# EAGLE design T4p1 (EAGLE 9.6.2)
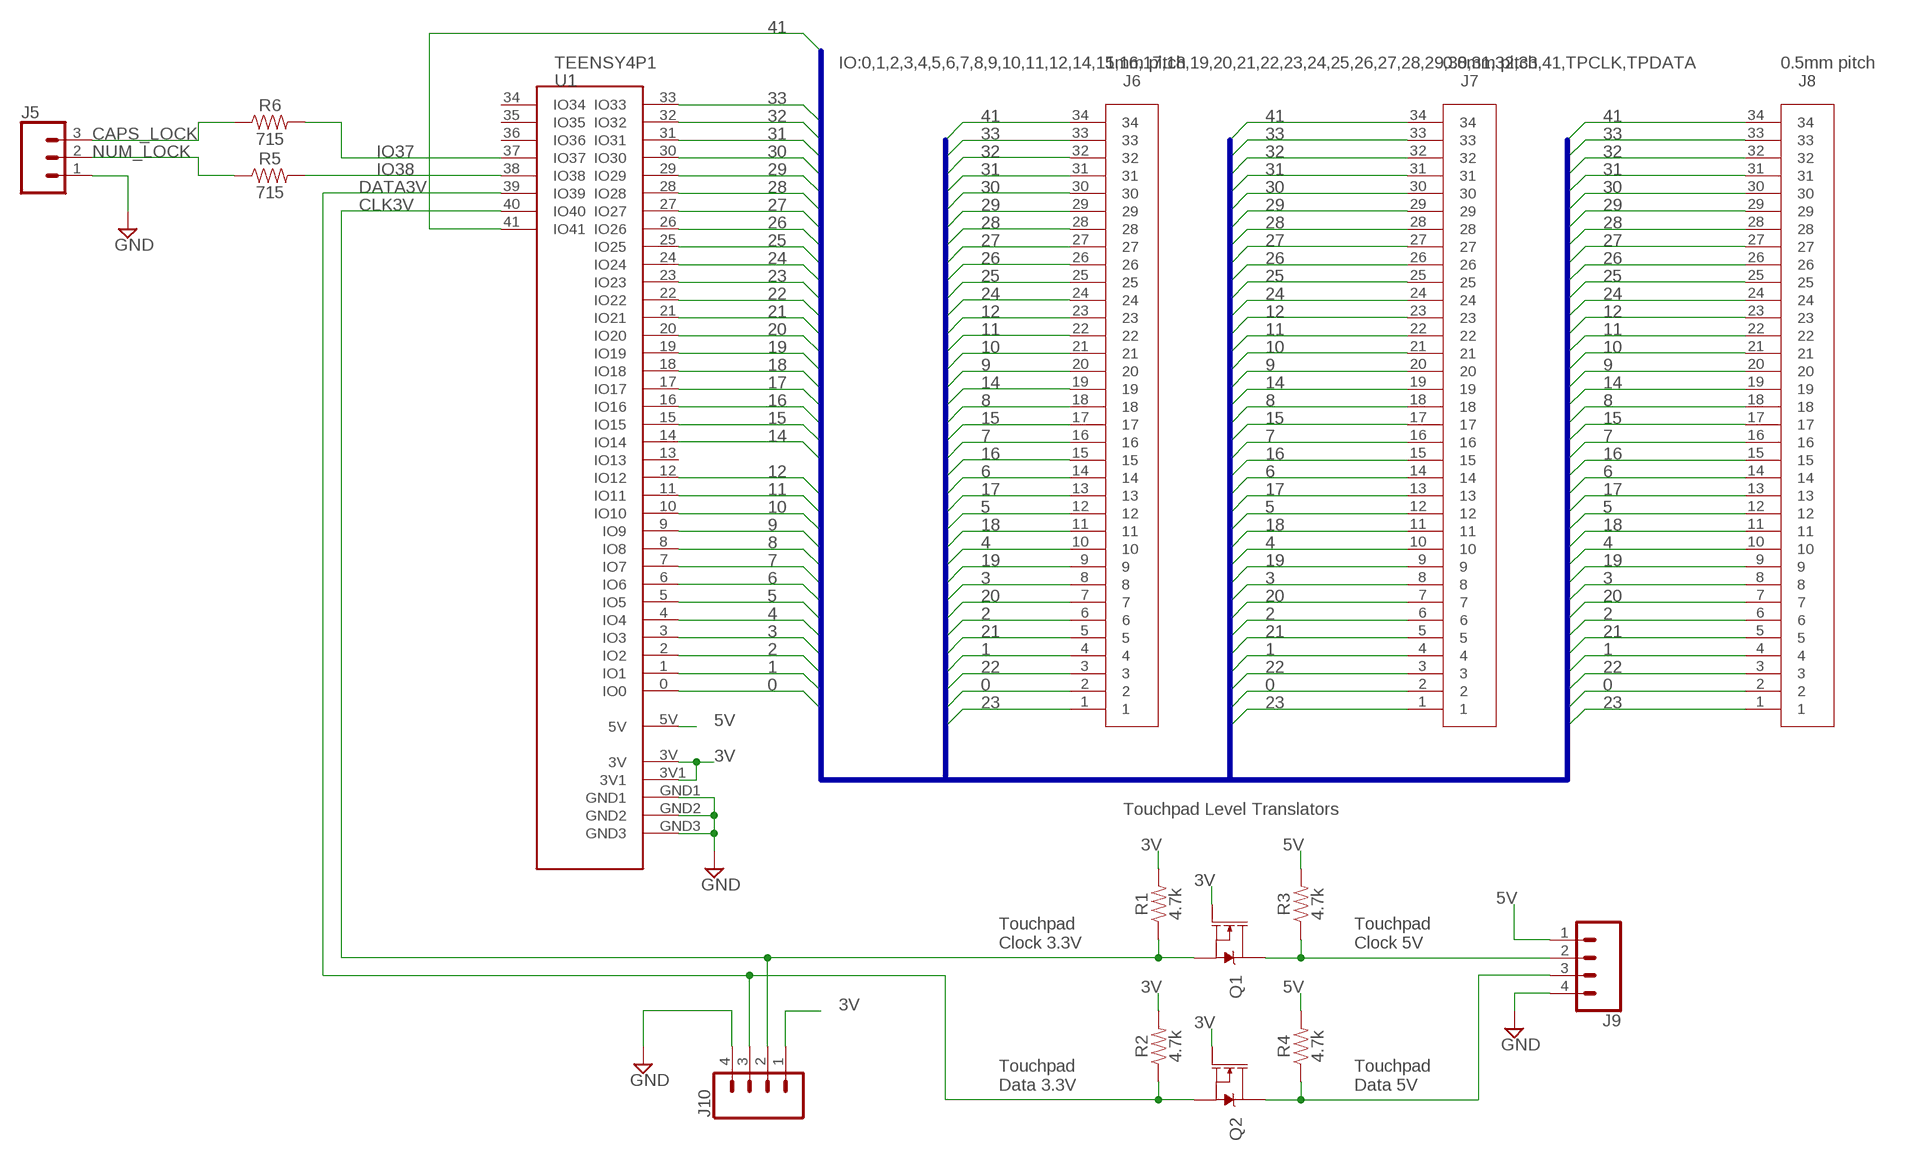
[diagram p0: schematic, sheet 1]

## Parts
J5  CONN_031X03_NO_SILK  [1X03_NO_SILK]
J6  FPC34  [FPC34]
J7  FPC34_P8MM  [FPC34_P8MM]
J8  FPC34_P5MM  [FPC34_P5MM]
J9  CONN_041X04_NO_SILK  [1X04_NO_SILK]
J10  CONN_041X04_NO_SILK  [1X04_NO_SILK]
Q1  220mA/50V/3.5Ω  MOSFET-NCH-BSS138  [SOT23-3]
Q2  220mA/50V/3.5Ω  MOSFET-NCH-BSS138  [SOT23-3]
R1  4.7k  4.7KOHM-0603-1/10W-1%  [0603]
R2  4.7k  4.7KOHM-0603-1/10W-1%  [0603]
R3  4.7k  4.7KOHM-0603-1/10W-1%  [0603]
R4  4.7k  4.7KOHM-0603-1/10W-1%  [0603]
R5  715  715OHM-0603-1/10W-1%  [0603]
R6  715  715OHM-0603-1/10W-1%  [0603]
U1  TEENSY4P1  TEENSYP41  [TEENSY4P1]

## Nets
0: J6.2 J7.2 J8.2 U1.0(IO0)
1: J6.4 J7.4 J8.4 U1.1(IO1)
2: J6.6 J7.6 J8.6 U1.2(IO2)
3: J6.8 J7.8 J8.8 U1.3(IO3)
3V: J10.1 Q1.1(G) Q2.1(G) R1.2 R2.2 U1.3V U1.3V1
4: J6.10 J7.10 J8.10 U1.4(IO4)
5: J6.12 J7.12 J8.12 U1.5(IO5)
5V: J9.1 R3.2 R4.2 U1.5V
6: J6.14 J7.14 J8.14 U1.6(IO6)
7: J6.16 J7.16 J8.16 U1.7(IO7)
8: J6.18 J7.18 J8.18 U1.8(IO8)
9: J6.20 J7.20 J8.20 U1.9(IO9)
10: J6.21 J7.21 J8.21 U1.10(IO10)
11: J6.22 J7.22 J8.22 U1.11(IO11)
12: J6.23 J7.23 J8.23 U1.12(IO12)
14: J6.19 J7.19 J8.19 U1.14(IO14)
15: J6.17 J7.17 J8.17 U1.15(IO15)
16: J6.15 J7.15 J8.15 U1.16(IO16)
17: J6.13 J7.13 J8.13 U1.17(IO17)
18: J6.11 J7.11 J8.11 U1.18(IO18)
19: J6.9 J7.9 J8.9 U1.19(IO19)
20: J6.7 J7.7 J8.7 U1.20(IO20)
21: J6.5 J7.5 J8.5 U1.21(IO21)
22: J6.3 J7.3 J8.3 U1.22(IO22)
23: J6.1 J7.1 J8.1 U1.23(IO23)
24: J6.24 J7.24 J8.24 U1.24(IO24)
25: J6.25 J7.25 J8.25 U1.25(IO25)
26: J6.26 J7.26 J8.26 U1.26(IO26)
27: J6.27 J7.27 J8.27 U1.27(IO27)
28: J6.28 J7.28 J8.28 U1.28(IO28)
29: J6.29 J7.29 J8.29 U1.29(IO29)
30: J6.30 J7.30 J8.30 U1.30(IO30)
31: J6.31 J7.31 J8.31 U1.31(IO31)
32: J6.32 J7.32 J8.32 U1.32(IO32)
33: J6.33 J7.33 J8.33 U1.33(IO33)
41: J6.34 J7.34 J8.34 U1.41(IO41)
CAPS_LOCK: J5.3 R6.1
CLK3V: J10.2 Q1.2(S) R1.1 U1.40(IO40)
CLK5V: J9.2 Q1.3(D) R3.1
DATA3V: J10.3 Q2.2(S) R2.1 U1.39(IO39)
DATA5V: J9.3 Q2.3(D) R4.1
GND: J5.1 J9.4 J10.4 U1.GND1 U1.GND2 U1.GND3
IO37: R6.2 U1.37(IO37)
IO38: R5.2 U1.38(IO38)
NUM_LOCK: J5.2 R5.1
Unconnected: U1.13(IO13) U1.34(IO34) U1.35(IO35) U1.36(IO36)

## Buses
IO:0,1,2,3,4,5,6,7,8,9,10,11,12,14,15,16,17,18,19,20,21,22,23,24,25,26,27,28,29,30,31,32,33,41,TPCLK,TPDATA

## Notes on the sheet
- 1mm pitch | 0.8mm pitch | 0.5mm pitch
- Touchpad Level Translators
- Touchpad
  Clock 3.3V
- Touchpad
  Clock 5V
- Touchpad
  Data 3.3V
- Touchpad
  Data 5V

## Library data of the parts
J5 = SparkFun-Connectors:CONN_03: Multi connection point. Often used as Generic Header-pin footprint for 0.1 inch spaced/style header connections On any of the 0.1 inch spaced packages, you can populate with these: Break Away Headers - Straight <https://www.sparkfun.com/products/116> (PRT-00116) Break Away Male Headers - Right Angle <https://www.sparkfun.com/products/553> (PRT-00553) Female Headers <https://www.sparkfun.com/products/115> (PRT-00115) Break Away Headers - Machine Pin <https://www.sparkfun.com/products/117> (PRT-00117) Break Away Female Headers - Swiss Machine Pin <https://www.sparkfun.com/products/743> (PRT-00743) Stackable Header - 3 Pin (Female, 0.1") <https://www.sparkfun.com/products/13875> (PRT-13875) For SCREWTERMINALS and SPRING TERMINALS visit here: Screw Terimnals on SparkFun.com <https://www.sparkfun.com/search/results?term=Screw+Terminals> (5mm/3.5mm/2.54mm spacing) This device is also useful as a general connection point to wire up your design to another part of your project. Our various solder wires solder well into these plated through hole pads. Hook-Up Wire - Assortment (Stranded, 22 AWG) <https://www.sparkfun.com/products/11375> (PRT-11375) Hook-Up Wire - Assortment (Solid Core, 22 AWG) <https://www.sparkfun.com/products/11367> (PRT-11367) View the entire wire category on our website here <https://www.sparkfun.com/categories/141> Special notes: Molex polarized connector foot print use with SKU : PRT-08232 with associated crimp pins and housings.
J6 = FPC34:FPC34: Molex Right Angle FPC Connector 1mm pitch, bottom contacts with 32 pins. Molex Part Number DigiKey Part Number
J7 = FPC34_p8mm:FPC34_P8MM: Molex Right Angle FPC Connector 1mm pitch, bottom contacts with 32 pins. Molex Part Number DigiKey Part Number
J8 = FPC34_p5mm:FPC34_P5MM: Molex Right Angle FPC Connector 1mm pitch, bottom contacts with 32 pins. Molex Part Number DigiKey Part Number
J9 J10 = SparkFun-Connectors:CONN_04: Multi connection point. Often used as Generic Header-pin footprint for 0.1 inch spaced/style header connections On any of the 0.1 inch spaced packages, you can populate with these: Break Away Headers - Straight <https://www.sparkfun.com/products/116> (PRT-00116) Break Away Male Headers - Right Angle <https://www.sparkfun.com/products/553> (PRT-00553) Female Headers <https://www.sparkfun.com/products/115> (PRT-00115) Break Away Headers - Machine Pin <https://www.sparkfun.com/products/117> (PRT-00117) Break Away Female Headers - Swiss Machine Pin <https://www.sparkfun.com/products/743> (PRT-00743) For SCREWTERMINALS and SPRING TERMINALS visit here: Screw Terimnals on SparkFun.com <https://www.sparkfun.com/search/results?term=Screw+Terminals> (5mm/3.5mm/2.54mm spacing) This device is also useful as a general connection point to wire up your design to another part of your project. Our various solder wires solder well into these plated through hole pads. Hook-Up Wire - Assortment (Stranded, 22 AWG) <https://www.sparkfun.com/products/11375> (PRT-11375) Hook-Up Wire - Assortment (Solid Core, 22 AWG) <https://www.sparkfun.com/products/11367> (PRT-11367) View the entire wire category on our website here <https://www.sparkfun.com/categories/141> Special notes: Molex polarized connector foot print use with SKU : PRT-08231 with associated crimp pins and housings. 1MM SMD Version SKU: PRT-10208; PROD_ID: CONN-09696
Q1 Q2 = SparkFun-DiscreteSemi:MOSFET-NCH: N-channel MOSFETs Voltage controlled devices that allow control of high current outputs. SparkFun Products: SparkFun OpenScale <https://www.sparkfun.com/products/13261> SparkFun Digital Sandbox <https://www.sparkfun.com/products/12651> SparkFun Monster Moto Shield <https://www.sparkfun.com/products/10182> SparkFun MOSFET Power Controller <https://www.sparkfun.com/products/11214>; PROD_ID: TRANS-00830
R1-R4 = SparkFun-Resistors:4.7KOHM: 4.7kΩ resistor A resistor is a passive two-terminal electrical component that implements electrical resistance as a circuit element. Resistors act to reduce current flow, and, at the same time, act to lower voltage levels within circuits. - Wikipedia; PROD_ID: RES-07857
R5 R6 = SparkFun-Resistors:715OHM: 715Ω resistor A resistor is a passive two-terminal electrical component that implements electrical resistance as a circuit element. Resistors act to reduce current flow, and, at the same time, act to lower voltage levels within circuits. - Wikipedia; PROD_ID: RES-07850
U1 = TEENSY4P1:TEENSYP41

## Board
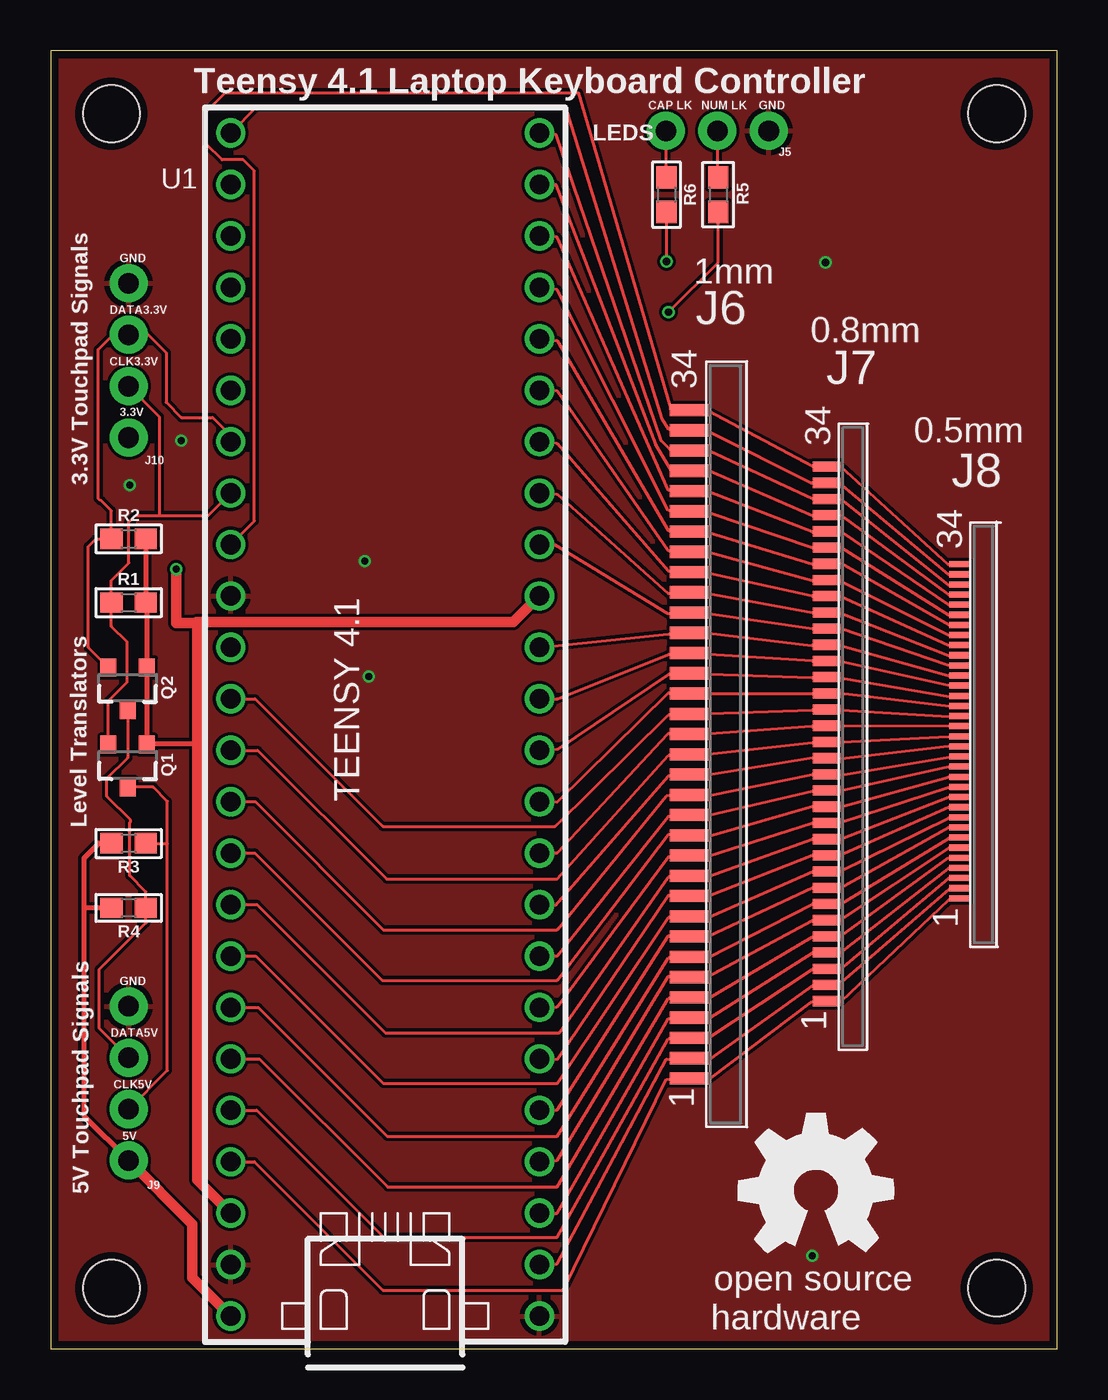
[diagram p1: board, top side]
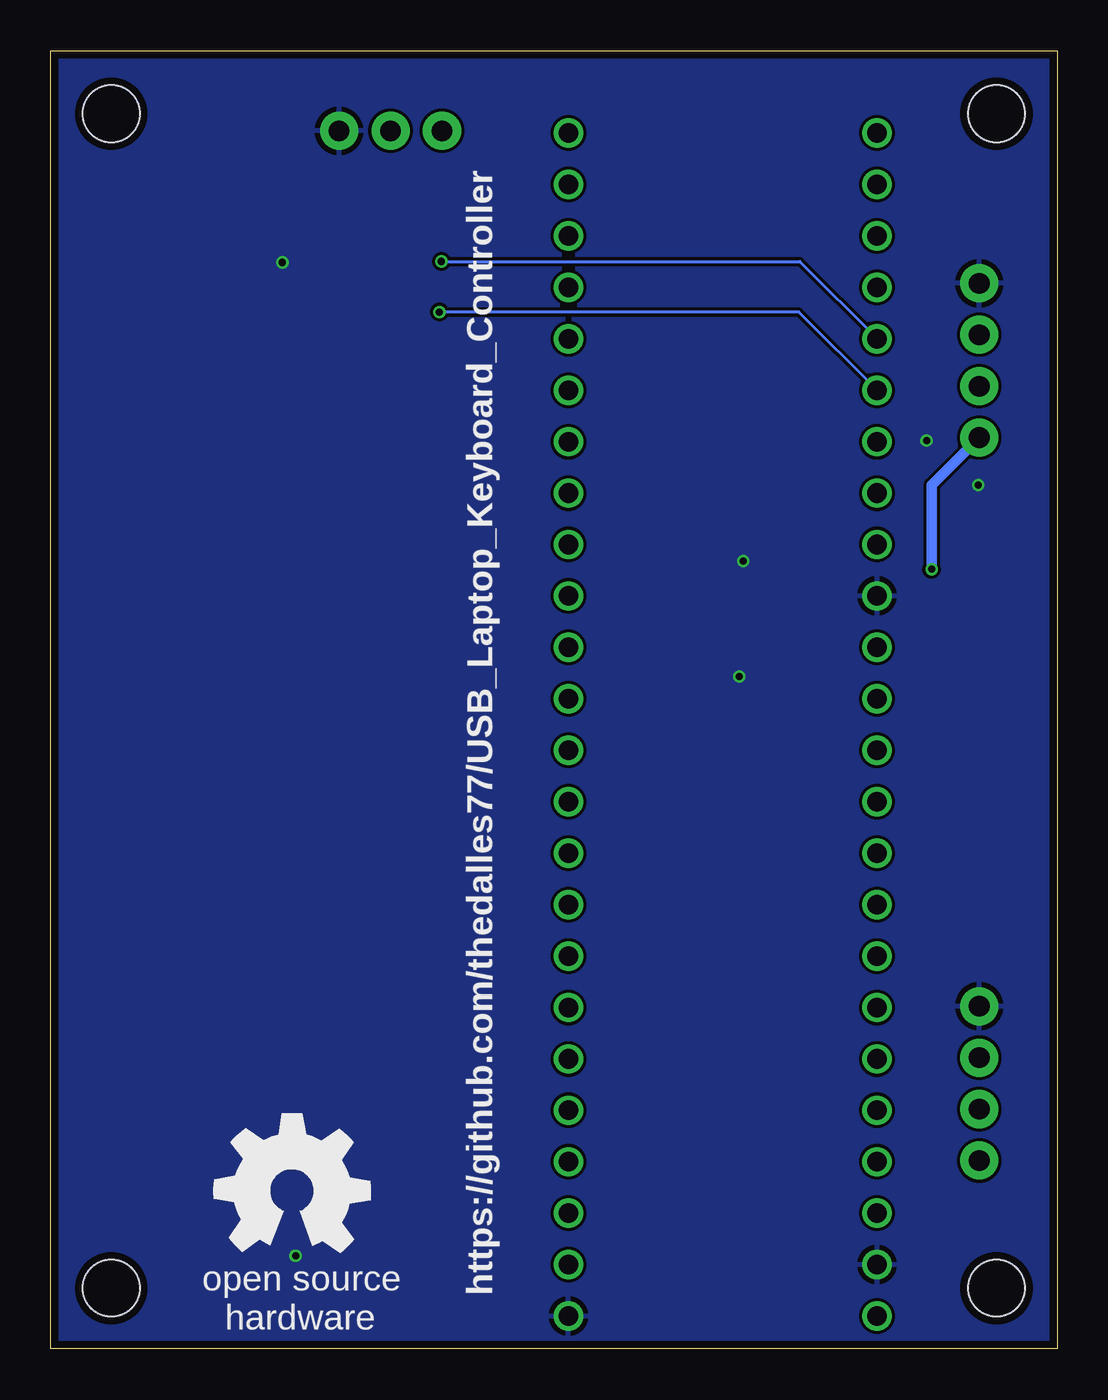
[diagram p2: board, bottom side, seen from below]

Size 49.69 x 64.11 mm. Coordinates in mm from the lower left corner, seen from the top.
Outline: 0,0 49.69,0 49.69,64.11 0,64.11 0,0
Copper layers (1*16): Top 0.035559375mm / dielectric 1.6mm / Bottom 0.035559375mm
Design rules "oshpark-2layer": minimum track width 6mil, minimum drill 10mil, track to track 6mil, track to pad 6mil, pad to pad 6mil, via to via 6mil, smd to smd 6mil, copper to edge 15mil, drill to drill 6mil, minimum pad ring 5mil, minimum via ring 5mil, stop-mask expansion 2.5mil, vias tented up to drill 0mil, thermal gap 10mil
Holes 2.8 mm at 3,3 46.7,3 46.7,61 3,61

### Footprints (pad centres in the part's own frame; a part is rotated, then mirrored left to right if it is on the bottom)
1X03_NO_SILK = drill 1.016 pad 1.88: 1 0,0; 2 2.54,0; 3 5.08,0
FPC34 = smd 0.6 x 1.9: 1 -13.7,3.86; 2 -12.7,3.86; 3 -11.7,3.86; 4 -10.7,3.86; 5 -9.7,3.86; 6 -8.7,3.86; 7 -7.7,3.86; 8 -6.7,3.86; 9 -5.7,3.86; 10 -4.7,3.86; 11 -3.7,3.86; 12 -2.7,3.86; 13 -1.7,3.86; 14 -0.7,3.86; 15 0.3,3.86; 16 1.3,3.86; 17 2.3,3.86; 18 3.3,3.86; 19 4.3,3.86; 20 5.3,3.86; 21 6.3,3.86; 22 7.3,3.86; 23 8.3,3.86; 24 9.3,3.86; 25 10.3,3.86; 26 11.3,3.86; 27 12.3,3.86; 28 13.3,3.86; 29 14.3,3.86; 30 15.3,3.86; 31 16.3,3.86; 32 17.3,3.86; 33 18.3,3.86; 34 19.3,3.86
FPC34_P8MM = smd 0.5 x 1.35: 1 -13.7,3.6; 2 -12.9,3.6; 3 -12.1,3.6; 4 -11.3,3.6; 5 -10.5,3.6; 6 -9.7,3.6; 7 -8.9,3.6; 8 -8.1,3.6; 9 -7.3,3.6; 10 -6.5,3.6; 11 -5.7,3.6; 12 -4.9,3.6; 13 -4.1,3.6; 14 -3.3,3.6; 15 -2.5,3.6; 16 -1.7,3.6; 17 -0.9,3.6; 18 -0.1,3.6; 19 0.7,3.6; 20 1.5,3.6; 21 2.3,3.6; 22 3.1,3.6; 23 3.9,3.6; 24 4.7,3.6; 25 5.5,3.6; 26 6.3,3.6; 27 7.1,3.6; 28 7.9,3.6; 29 8.7,3.6; 30 9.5,3.6; 31 10.3,3.6; 32 11.1,3.6; 33 11.9,3.6; 34 12.7,3.6
FPC34_P5MM = smd 0.3 x 1.1: 1 -13.7,3.5; 2 -13.2,3.5; 3 -12.7,3.5; 4 -12.2,3.5; 5 -11.7,3.5; 6 -11.2,3.5; 7 -10.7,3.5; 8 -10.2,3.5; 9 -9.7,3.5; 10 -9.2,3.5; 11 -8.7,3.5; 12 -8.2,3.5; 13 -7.7,3.5; 14 -7.2,3.5; 15 -6.7,3.5; 16 -6.2,3.5; 17 -5.7,3.5; 18 -5.2,3.5; 19 -4.7,3.5; 20 -4.2,3.5; 21 -3.7,3.5; 22 -3.2,3.5; 23 -2.7,3.5; 24 -2.2,3.5; 25 -1.7,3.5; 26 -1.2,3.5; 27 -0.7,3.5; 28 -0.2,3.5; 29 0.3,3.5; 30 0.8,3.5; 31 1.3,3.5; 32 1.8,3.5; 33 2.3,3.5; 34 2.8,3.5
1X04_NO_SILK = drill 1.016 pad 1.88: 1 0,0; 2 2.54,0; 3 5.08,0; 4 7.62,0
SOT23-3 = smd 0.8 x 0.9: 1 -0.95,-1; 2 0.95,-1; 3 0,1.1
0603 = smd 1.1 x 1: 1 -0.85,0; 2 0.85,0
TEENSY4P1 = drill 0.965: 0 -26.67,-6.35; 1 -24.13,-6.35; 2 -21.59,-6.35; 3 -19.05,-6.35; 3V -24.13,8.89; 3V1 6.35,-6.35; 4 -16.51,-6.35; 5 -13.97,-6.35; 5V -29.21,8.89; 6 -11.43,-6.35; 7 -8.89,-6.35; 8 -6.35,-6.35; 9 -3.81,-6.35; 10 -1.27,-6.35; 11 1.27,-6.35; 12 3.81,-6.35; 13 3.81,8.89; 14 1.27,8.89; 15 -1.27,8.89; 16 -3.81,8.89; 17 -6.35,8.89; 18 -8.89,8.89; 19 -11.43,8.89; 20 -13.97,8.89; 21 -16.51,8.89; 22 -19.05,8.89; 23 -21.59,8.89; 24 8.89,-6.35; 25 11.43,-6.35; 26 13.97,-6.35; 27 16.51,-6.35; 28 19.05,-6.35; 29 21.59,-6.35; 30 24.13,-6.35; 31 26.67,-6.35; 32 29.21,-6.35; 33 29.21,8.89; 34 26.67,8.89; 35 24.13,8.89; 36 21.59,8.89; 37 19.05,8.89; 38 16.51,8.89; 39 13.97,8.89; 40 11.43,8.89; 41 8.89,8.89; GND1 -29.21,-6.35; GND2 -26.67,8.89; GND3 6.35,8.89

### Placement (x,y rotation side)
J5  35.45,60.15 180 top
J6  35.37,27.06 90 top
J7  41.9,30.87 90 top
J8  48.4,35.95 90 top
J9  3.85,9.3 90 top
J10  3.85,45 90 top
Q1  3.8,28.84 180 top
Q2  3.8,32.65 180 top
R1  3.85,36.85 0 top
R2  3.85,40 0 top
R3  3.85,24.97 180 top
R4  3.85,21.78 180 top
R5  32.95,57 270 top
R6  30.4,57 270 top
U1  17.78,30.83 90 top
U$1  [OSHW_8MM]  37.75,7.8 0 top
U$2  [OSHW_8MM]  37.75,7.8 0 top

### Tracks (layer width: path | path; a pad name or v marks a point on that pad's centre or on a via)
0
  Top 0.152: U1.0 25,4.2 30.4,14.3 J6.2 32.61,14.35 37.65,17.96 J7.2 39.06,18.11 44.36,22.72 J8.2
1
  Top 0.152: U1.1 25,6.7 30.5,16.3 J6.4 32.52,16.33 37.61,19.56 J7.4 39.01,19.58 44.32,23.73 J8.4
2
  Top 0.152: U1.2 25,9.3 30.5,18.4 J6.6 32.41,18.35 37.6,21.13 J7.6 38.99,21.18 44.33,24.73 J8.6
3
  Top 0.152: U1.3 25,11.8 30.5,20.4 J6.8 32.48,20.36 37.63,22.75 J7.8 38.99,22.74 44.35,25.75 J8.8
3V  (via drill 0.35)
  Top 0.254: R2.2 R1.2 4.75,36.8 Q2.1 Q1.1 4.75,29.9 7.24,29.9 | 7.24,35.86 7.21,35.89
  Top 0.508: U1.3V1 22.84,35.89 7.21,35.89 | U1.3V 7.24,8.35 7.24,29.9 7.24,35.85 | v6.2,38.5 6.2,35.85 7.24,35.85 | 7.24,35.85 7.24,35.86
  Bottom 0.508: v6.2,38.5 6.2,42.65 J10.1
4
  Top 0.152: U1.4 25,14.3 30.5,22.4 J6.10 32.46,22.35 37.61,24.36 J7.10 38.99,24.36 44.33,26.73 J8.10
5
  Top 0.152: U1.5 25,16.9 30.5,24.3 J6.12 32.48,24.32 37.6,25.94 J7.12 38.99,25.98 44.35,27.72 J8.12
5V
  Top 0.254: R3.2 2.4,24.97 2.39,24.98 1.64,24.23 1.64,21.78 | 1.64,21.78 1.64,11.52 J9.1 | R4.2 1.64,21.78
  Top 0.508: U1.5V 7,3.51 7,6.15 J9.1
6
  Top 0.152: U1.6 25,19.4 30.5,26.3 J6.14 32.5,26.35 37.6,27.53 J7.14 39.01,27.54 44.32,28.73 J8.14
7
  Top 0.152: U1.7 24.9,21.9 30.5,28.3 31.43,28.36 | 31.43,28.36 J6.16 | 31.43,28.36 32.5,28.34 37.63,29.17 J7.16 39.03,29.14 44.32,29.75 J8.16
8
  Top 0.152: U1.8 25,24.5 30.5,30.4 J6.18 32.5,30.36 37.58,30.73 J7.18 39.01,30.73 44.34,30.75 J8.18
9
  Top 0.152: U1.9 25,27 30.5,32.4 J6.20 32.45,32.35 37.61,32.35 J7.20 38.98,32.37 44.36,31.72 J8.20
10
  Top 0.152: U1.10 25,29.6 30.5,33.3 J6.21 32.48,33.33 37.58,33.15 J7.21 39.03,33.12 44.36,32.21 J8.21
11
  Top 0.152: U1.11 25,32.1 30.5,34.3 J6.22 32.46,34.29 37.61,33.96 J7.22 38.99,33.94 44.32,32.77 J8.22
12
  Top 0.152: U1.12 30.5,35.3 J6.23 32.46,35.34 37.58,34.74 J7.23 39.01,34.73 44.32,33.26 J8.23
14
  Top 0.152: J8.19 44.39,31.23 39.01,31.55 J7.19 37.6,31.55 32.5,31.37 J6.19 30.5,31.3 24.9,25.8 16.4,25.8 10.1,32.1 U1.14
15
  Top 0.152: J8.17 44.34,30.24 39.03,29.96 J7.17 37.6,29.94 32.48,29.38 J6.17 30.5,29.3 25,23.2 16.58,23.2 10.22,29.56 U1.15
16
  Top 0.152: J8.15 44.36,29.24 39.04,28.34 J7.15 37.6,28.37 32.5,27.34 J6.15 30.4,27.3 25,20.7 16.43,20.7 10.11,27.02 U1.16
17
  Top 0.152: J8.13 44.33,28.25 38.98,26.77 J7.13 37.65,26.8 32.5,25.33 J6.13 30.5,25.4 25,18.2 16.36,18.2 10.08,24.48 U1.17
18
  Top 0.152: J8.11 44.33,27.25 39.01,25.18 J7.11 37.61,25.19 32.46,23.33 J6.11 30.5,23.3 25.1,15.6 16.52,15.6 10.18,21.94 U1.18
19
  Top 0.152: J8.9 44.33,26.23 38.95,23.58 J7.9 37.63,23.57 32.5,21.34 J6.9 30.5,21.3 25,13.1 16.42,13.1 10.12,19.4 U1.19
20
  Top 0.152: J8.7 44.33,25.21 38.97,21.96 J7.7 37.61,21.98 32.46,19.33 J6.7 30.5,19.3 25,10.5 16.61,10.5 10.25,16.86 U1.20
21
  Top 0.152: J8.5 44.32,24.24 39.02,20.4 J7.5 37.6,20.34 32.5,17.34 J6.5 30.5,17.3 25,8 16.63,8 10.31,14.32 U1.21
22
  Top 0.152: J8.3 44.33,23.24 39.01,18.73 J7.3 37.6,18.75 32.5,15.38 J6.3 30.5,15.3 25,5.5 16.45,5.5 10.17,11.78 U1.22
23
  Top 0.152: U1.23 10.06,9.24 16.4,2.9 25.3,2.9 30.4,13.3 J6.1 32.52,13.3 37.57,17.13 J7.1 39.04,17.17 44.37,22.2 J8.1
24
  Top 0.152: U1.24 24.9,39.7 30.5,36.3 J6.24 32.48,36.28 37.61,35.55 J7.24 38.98,35.56 44.32,33.75 J8.24
25
  Top 0.152: U1.25 25,42.2 30.5,37.3 J6.25 32.48,37.31 37.6,36.35 J7.25 39.01,36.33 44.34,34.24 J8.25
26
  Top 0.152: U1.26 25,44.7 30.5,38.4 J6.26 32.5,38.29 37.58,37.17 J7.26 38.99,37.15 44.32,34.74 J8.26
27
  Top 0.152: U1.27 25,47.3 30.5,39.4 J6.27 32.48,39.35 37.61,37.95 J7.27 39.01,37.92 44.34,35.25 J8.27
28
  Top 0.152: U1.28 25,49.8 30.5,40.4 J6.28 | J6.28 | J7.28 38.24,38.77 | 38.24,38.77 37.61,38.74 32.5,40.28 J6.28 | J8.28 44.34,35.74 39.03,38.79 38.24,38.77
29
  Top 0.152: U1.29 25,52.3 30.5,41.4 J6.29 32.52,41.31 37.61,39.56 J7.29 39.03,39.56 44.34,36.24 J8.29
30
  Top 0.152: U1.30 25,54.9 30.5,42.4 J6.30 32.5,42.32 37.61,40.33 J7.30 39.03,40.35 44.36,36.73 J8.30
31
  Top 0.152: U1.31 24.94,57.5 29.86,44.63 30.6,43.4 J6.31 32.5,43.37 37.61,41.15 J7.31 39.03,41.15 44.32,37.26 J8.31
32
  Top 0.152: U1.32 24.95,59.97 30.13,44.85 30.56,44.43 J6.32 32.5,44.33 37.61,41.97 J7.32 39.03,41.93 44.32,37.73 J8.32
33
  Top 0.152: U1.33 10.18,61.33 25.43,61.33 30.18,45.92 30.52,45.4 J6.33 32.52,45.3 37.58,42.76 J7.33 38.99,42.74 44.34,38.23 J8.33
41
  Top 0.152: U1.41 10.06,40.89 10.06,58.17 9.51,58.72 8.47,58.72 7.69,59.5 7.69,61.09 8.63,62.03 26.05,62.03 30.61,46.4 J6.34 32.45,46.32 37.61,43.58 J7.34 38.99,43.59 44.32,38.74 J8.34
CAPS_LOCK
  Top 0.152: J5.3 30.37,57.88 R6.1
CLK3V
  Top 0.152: Q1.2 2.85,32 3.77,32.92 3.77,34.91 3,35.68 R1.1 3,37.95 3.86,38.81 3.86,40.83 4.18,41.15 5.35,41.15 | U1.40 7.78,41.15 5.35,41.15 | J10.2 5.35,46.04 5.35,41.15
CLK5V
  Top 0.152: J9.2 5.76,13.75 5.76,24.95 | 5.76,24.95 5.76,27.04 5.06,27.74 Q1.3 | R3.1 5.74,24.97 5.76,24.95
DATA3V
  Top 0.152: Q2.2 1.86,34.64 1.86,39.63 2.23,40 R2.1 3,41.39 2.49,41.9 2.45,41.9 2.35,42 2.35,49.35 3.08,50.08 J10.3 4.82,50.08 5.7,49.2 5.7,46.75 6.45,46 8,46 8.89,45.11 U1.39
DATA5V
  Top 0.152: J9.3 2.41,15.82 2.41,18.74 4.7,21.03 4.7,21.68 4.65,21.73 | R4.1 4.7,22.57 3.9,23.37 3.9,25.98 3.95,26.03 3.95,26.11 2.77,27.29 2.77,28.16 3.8,29.19 Q2.3
  Top 0.254: 4.65,21.73 R4.1
GND  (via drill 0.35)
  Top 0.152: 15.5,38.88 v15.5,38.9
  other vias: 15.7,33.2 38.25,53.65 37.6,4.6 6.45,44.85 3.9,42.65
  pour Top: -0.01,0 -0.01,64.09 49.68,64.09 49.68,0
  pour Bottom: 0,0 0,64.1 49.7,64.1 49.7,0
IO37  (via drill 0.35)
  Top 0.152: R6.2 v30.4,53.7
  Bottom 0.152: v30.4,53.7 12.71,53.7 U1.37
IO38  (via drill 0.35)
  Top 0.152: v30.5,51.2 32.95,53.65 R5.2
  Bottom 0.152: U1.38 12.75,51.2 v30.5,51.2
NUM_LOCK
  Top 0.152: J5.2 32.91,57.89 R5.1

### Text on the board
tPlace: Teensy 4.1 Laptop Keyboard Controller | CAP LK | NUM LK | GND | LEDS | U1 | GND | 1mm | DATA3.3V | 0.8mm | CLK3.3V | 34 | 3.3V | 34 | 0.5mm | 3.3V Touchpad Signals | 34 | Level Translators | GND | DATA5V | CLK5V | 5V | 5V Touchpad Signals
bPlace: https://github.com/thedalles77/USB_Laptop_Keyboard_Controller